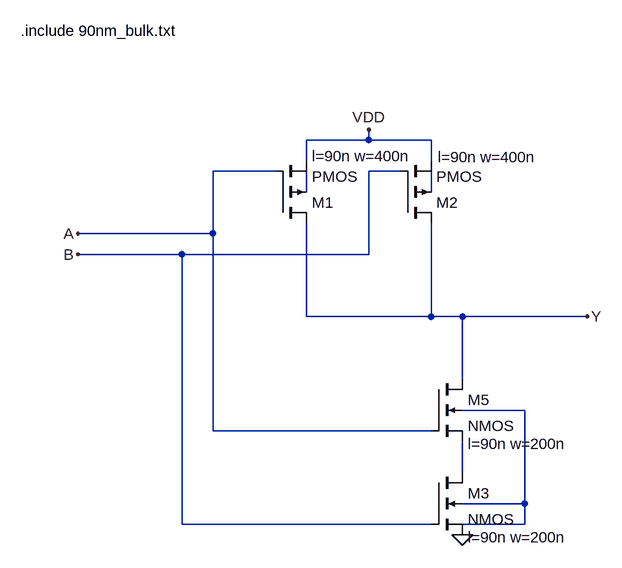
[diagram p0: schematic NAND.asc]
NAND.asc, the LTspice schematic file:
Version 4
SHEET 1 880 804
WIRE 432 176 432 160
WIRE 432 176 336 176
WIRE 528 176 432 176
WIRE 336 208 336 176
WIRE 528 208 528 176
WIRE 288 224 192 224
WIRE 480 224 432 224
WIRE 336 256 336 224
WIRE 528 256 528 224
WIRE 192 320 192 224
WIRE 192 320 -16 320
WIRE 144 352 -16 352
WIRE 432 352 432 224
WIRE 432 352 144 352
WIRE 336 448 336 304
WIRE 528 448 528 304
WIRE 528 448 336 448
WIRE 576 448 528 448
WIRE 768 448 576 448
WIRE 576 544 576 448
WIRE 672 592 576 592
WIRE 192 624 192 320
WIRE 528 624 192 624
WIRE 576 688 576 640
WIRE 672 736 672 592
WIRE 672 736 576 736
WIRE 144 768 144 352
WIRE 528 768 144 768
WIRE 672 768 672 736
WIRE 672 768 576 768
FLAG -16 320 A
FLAG -16 352 B
FLAG 432 160 VDD
FLAG 576 784 0
FLAG 768 448 Y
SYMBOL nmos4 528 544 R0
WINDOW 123 56 100 Left 2
SYMATTR InstName M5
SYMATTR Value2 l=90n w=200n
SYMBOL nmos4 528 688 R0
WINDOW 123 56 100 Left 2
SYMATTR InstName M3
SYMATTR Value2 l=90n w=200n
SYMBOL pmos4 288 304 M180
WINDOW 123 56 103 Left 2
SYMATTR InstName M1
SYMATTR Value2 l=90n w=400n
SYMBOL pmos4 480 304 M180
WINDOW 123 58 102 Left 2
SYMATTR InstName M2
SYMATTR Value2 l=90n w=400n
TEXT -104 8 Left 2 !.include 90nm_bulk.txt

The netlist it stands for:
* NAND.asc
M5 Y A N004 N003 NMOS l=90n w=200n
M3 N004 B 0 N003 NMOS l=90n w=200n
M1 Y A VDD N001 PMOS l=90n w=400n
M2 Y B VDD N002 PMOS l=90n w=400n
.model NMOS NMOS
.model PMOS PMOS
.lib standard.mos
.include 90nm_bulk.txt
.backanno
.end